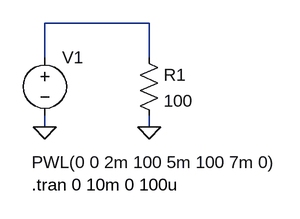
[diagram p0: schematic Random.asc]
Random.asc, the LTspice schematic file:
Version 4
SHEET 1 880 680
WIRE 272 64 128 64
WIRE 128 112 128 64
WIRE 272 112 272 64
WIRE 128 208 128 192
WIRE 272 208 272 192
FLAG 128 208 0
FLAG 272 208 0
SYMBOL voltage 128 96 R0
WINDOW 3 -18 161 Left 2
WINDOW 123 0 0 Left 0
WINDOW 39 0 0 Left 0
SYMATTR InstName V1
SYMATTR Value PWL(0 0 2m 100 5m 100 7m 0)
SYMBOL res 256 96 R0
SYMATTR InstName R1
SYMATTR Value 100
TEXT 110 288 Left 2 !.tran 0 10m 0 100u

The netlist it stands for:
* Random.asc
V1 N001 0 PWL(0 0 2m 100 5m 100 7m 0)
R1 N001 0 100
.tran 0 10m 0 100u
.backanno
.end